# Altium schematic sheet Display.SchDoc
size A4
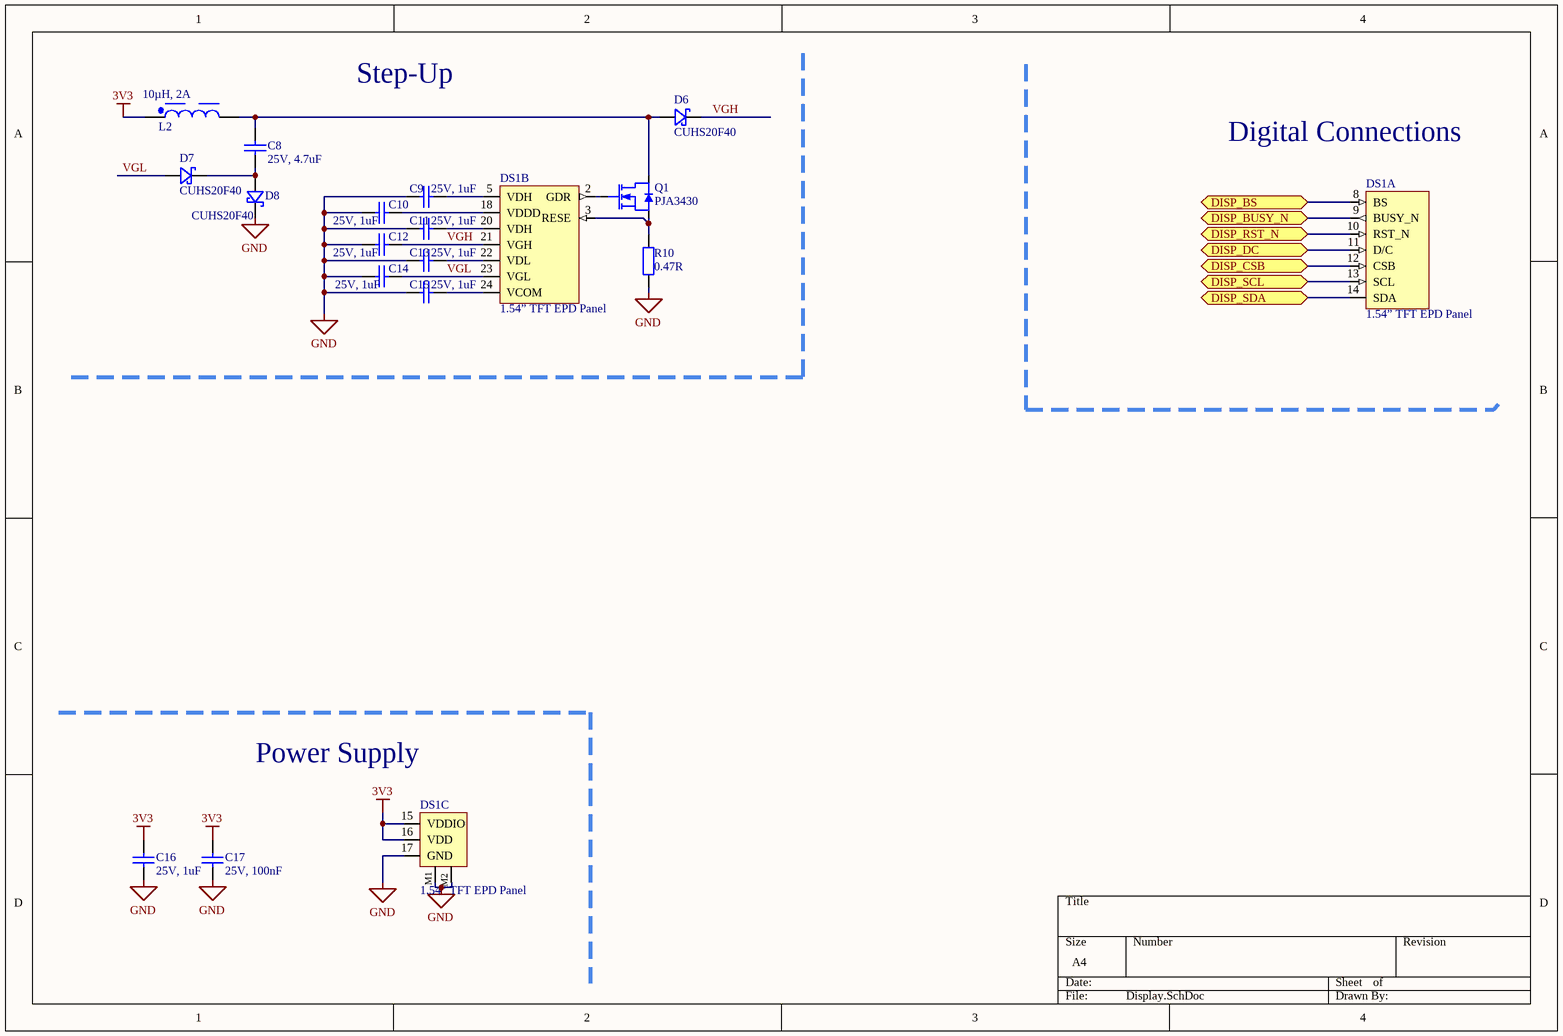
[diagram p0: Display.SchDoc]

## Parts
C8  25V, 4.7uF  [0805_2x1.25x1.25mm_Reflow Soldering]
C9  25V, 1uF  [0603_1.6x0.8x0.8mm_Reflow Soldering]
C10  25V, 1uF  [0603_1.6x0.8x0.8mm_Reflow Soldering]
C11  25V, 1uF  [0603_1.6x0.8x0.8mm_Reflow Soldering]
C12  25V, 1uF  [0603_1.6x0.8x0.8mm_Reflow Soldering]
C13  25V, 1uF  [0603_1.6x0.8x0.8mm_Reflow Soldering]
C14  25V, 1uF  [0603_1.6x0.8x0.8mm_Reflow Soldering]
C15  25V, 1uF  [0603_1.6x0.8x0.8mm_Reflow Soldering]
C16  25V, 1uF  [0603_1.6x0.8x0.8mm_Reflow Soldering]
C17  25V, 100nF  [0402_1x0.5x0.5mm]
D6  CUHS20F40  [Topshiba US2H]
D7  CUHS20F40  [Topshiba US2H]
D8  CUHS20F40  [Topshiba US2H]
DS1  1.54” TFT EPD Panel  [687324124422]  (parts A,B,C of 4)
L2  10µH, 2A  [WE-TPC_8020]
Q1  PJA3430  [SOT23]
R10  value 0.47R  [RES0805_1]  (hidden comment: Res2-smd)

## Ports
DISP_BS (bidir), DISP_BUSY_N (bidir), DISP_CSB (bidir), DISP_DC (bidir), DISP_RST_N (bidir), DISP_SCL (bidir), DISP_SDA (bidir)

## Nets
3V3: C16.2 C17.2 DS1.15(VDDIO) DS1.16(VDD) L2.1
GND: C9.1 C10.1 C11.1 C12.1 C13.1 C14.1 C15.1 C16.1 C17.1 D8.1(K) DS1.17(GND) DS1.M1 DS1.M2 R10.1
DISP_BS: DS1.8(BS) ; port DISP_BS
DISP_BUSY_N: DS1.9(BUSY_N) ; port DISP_BUSY_N
DISP_CSB: DS1.12(CSB) ; port DISP_CSB
DISP_DC: DS1.11(D/C) ; port DISP_DC
DISP_RST_N: DS1.10(RST_N) ; port DISP_RST_N
DISP_SCL: DS1.13(SCL) ; port DISP_SCL
DISP_SDA: DS1.14(SDA) ; port DISP_SDA
VGH: C12.2 D6.1(K) DS1.21(VGH)
VGL: C14.2 D7.2(A) DS1.23(VGL)
NetC8_1: C8.1 D7.1(K) D8.2(A)
NetC8_2: C8.2 D6.2(A) L2.2 Q1.3(D)
NetC9_2: C9.2 DS1.5(VDH)
NetC10_2: C10.2 DS1.18(VDDD)
NetC11_2: C11.2 DS1.20(VDH)
NetC13_2: C13.2 DS1.22(VDL)
NetC15_2: C15.2 DS1.24(VCOM)
NetDS1_2: DS1.2(GDR) Q1.1(G)
NetDS1_3: DS1.3(RESE) Q1.2(S) R10.2

## Notes on the sheet
- Step-Up
- (near DS1) Digital Connections
- (near DS1) Power Supply

## Library data of the parts
C8 = 885012107018: WCAP-CSGP Ceramic Capacitors, 0805, X5R, 25V, 4.7uF; Rated Voltage: 25V DC; ComponentLink1Description: Manufacturer; ComponentLink1URL: http://www.we-online.de; ComponentLink2Description: Datasheet; ComponentLink2URL: http://katalog.we-online.de/pbs/datasheet/885012107018.pdf; Part Number: 885012107018; Published Date: Oct. 2017; Publisher: Wurth Elektronik; Size: 0805; Operating Temperature: -55 °C to +125 °C; Value: 4.7uF; Ceramic Type: X5R
C9-C16 = 885012106022: WCAP-CSGP Ceramic Capacitors, 0603, X5R, 25V, 1uF; Rated Voltage: 25V DC; ComponentLink1Description: Manufacturer; ComponentLink1URL: http://www.we-online.de; ComponentLink2Description: Datasheet; ComponentLink2URL: http://katalog.we-online.de/pbs/datasheet/885012106022.pdf; Part Number: 885012106022; Published Date: Oct. 2017; Publisher: Wurth Elektronik; Size: 0603; Operating Temperature: -55 °C to +125 °C; Value: 1uF; Ceramic Type: X5R
C17 = 885012105018: WCAP-CSGP Ceramic Capacitors, 0402, X5R, 25V, 100nF; Rated Voltage: 25V DC; ComponentLink1Description: Manufacturer; ComponentLink1URL: http://www.we-online.de; ComponentLink2Description: Datasheet; ComponentLink2URL: http://katalog.we-online.de/pbs/datasheet/885012105018.pdf; Part Number: 885012105018; Published Date: Oct. 2017; Publisher: Wurth Elektronik; Size: 0402; Operating Temperature: -55 °C to +125 °C; Value: 100nF; Ceramic Type: X5R
D6-D8 = CUHS20F40: Schottky Barrier Diode Silicon Epitaxia
DS1 = E2154CS0C1: Wurth 687124183622 connector for horizontal, / Wurth 687324124422 for vertical
L2 = 7440700100: WE-TPC SMT Tiny Power Inductor, 8020, 10µH, 2A, 94mΩ; Manufacturer: Wurth Elektronik; Case/Size Code: 8020; DC Resistance: 78mΩ; Saturation Current: 1.55A; Self Resonant Frequency: 30MHz; ComponentLink1Description: Website Link; ComponentLink1URL: https://www.we-online.com/redexpert/article/7440700100?ad; ComponentLink2Description: Datasheet Link; ComponentLink2URL: https://www.we-online.com/redexpert/spec/7440700100?ad; Manufacturer Part Number: 7440700100; Category: Shielded Power Inductors; Match Code: WE-TPC; Mount: Surface Mount; Operating Temperature Max: 125°C; Operating Temperature Min: -40°C; Packaging: Tape and Reel; Length: 8mm; Width: 8mm; Height: 1.8mm; DC Resistance Max: 94mΩ; Inductance: 10µH; Rated Current: 2A
Q1 = PJA3430_R1_00001: 20V/2A N-Channel Enhancment Mode MOSFET